# EAGLE design SerLCD_20x4_pb-v01 (EAGLE 7.6.0)
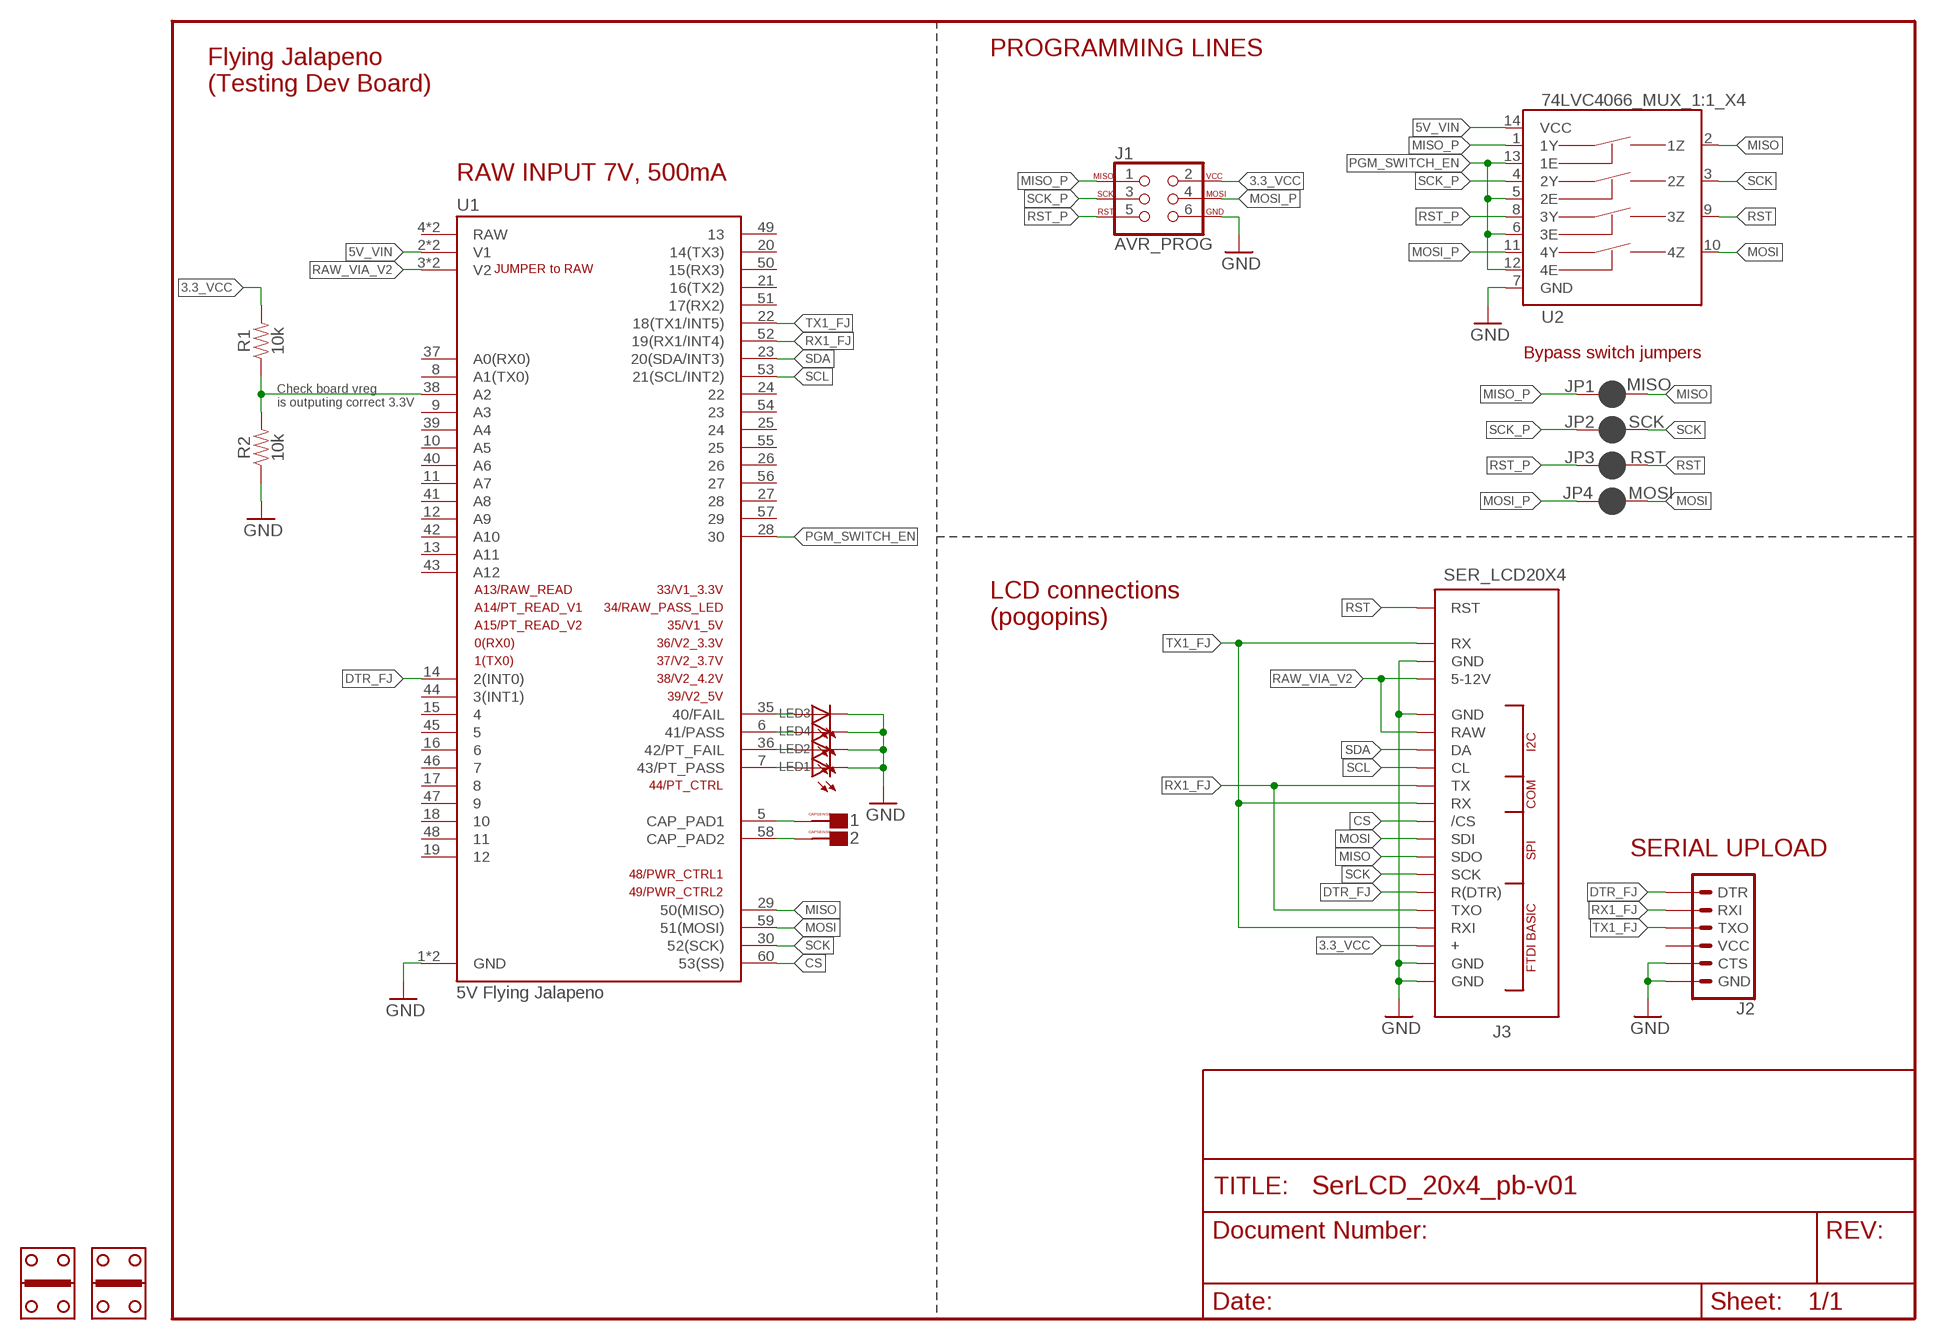
[diagram p0: schematic, sheet 1]

## Parts
1  CAPSENSE_BUTTON_PAD_ONLY  [CAPSENSE_BUTTON_PADS_ONLY]
2  CAPSENSE_BUTTON_PAD_ONLY  [CAPSENSE_BUTTON_PADS_ONLY]
J1  AVR_PROG  AVR_SPI_PROG_3X22X3_LOCK  [2X3_LOCK]
J2  6_PIN_SERIAL_TARGETLOCK  [1X06_LOCK]
J3  SER_LCD20X4  [SER_LCD_20X4]
JP1  MISO  JUMPER-SMT_2_NC_PASTE_NO-SILK  [SMT-JUMPER_2_NC_PASTE_NO-SILK]
JP2  SCK  JUMPER-SMT_2_NC_PASTE_NO-SILK  [SMT-JUMPER_2_NC_PASTE_NO-SILK]
JP3  RST  JUMPER-SMT_2_NC_PASTE_NO-SILK  [SMT-JUMPER_2_NC_PASTE_NO-SILK]
JP4  MOSI  JUMPER-SMT_2_NC_PASTE_NO-SILK  [SMT-JUMPER_2_NC_PASTE_NO-SILK]
LED1  LED1206  [LED-1206]
LED2  LED1206  [LED-1206]
LED3  LED1206  [LED-1206]
LED4  LED1206  [LED-1206]
R1  10k  10KOHM-0603-1/10W-1%  [0603]
R2  10k  10KOHM-0603-1/10W-1%  [0603]
U1  5V Flying Jalapeno  FLYING_JALAPENO_V2MALE  [FLYING_JALAPENO_V2_M]
U2  74LVC4066_MUX_1:1_X4  [SO14]
U$6  GOLD_HINDGEPB  [GOLD_HINDGE]
U$7  GOLD_HINDGEPB  [GOLD_HINDGE]

## Nets
3.3_VCC: J1.2 J3.P$3(+) R1.2
5V_VIN [twelve_mil]: U1.2(V1) U1.32(V1) U2.14(VCC)
CS: J3.P$10(/CS) U1.60(53(SS))
DTR_FJ: J2.1(DTR) J3.P$6(R(DTR)) U1.14(2(INT0))
GND [twelve_mil]: J1.6 J2.5(CTS) J2.6(GND) J3.P$1(GND) J3.P$2(GND) J3.P$16(GND) J3.P$18(GND) LED1.C LED2.C LED3.C LED4.C R2.1 U1.1(GND) U1.31(GND) U2.7(GND)
MISO: J3.P$8(SDO) JP1.2 U1.29(50(MISO)) U2.2(1Z)
MISO_P: J1.1 JP1.1 U2.1(1Y)
MOSI: J3.P$9(SDI) JP4.2 U1.59(51(MOSI)) U2.10(4Z)
MOSI_P: J1.4 JP4.1 U2.11(4Y)
N$1 [eight_mil]: 1.CAPSENSE_PAD(CAPSENSE) U1.5(CAP_PAD1)
N$2: 2.CAPSENSE_PAD(CAPSENSE) U1.58(CAP_PAD2)
N$3 [eight_mil]: LED1.A U1.7(43/PT_PASS)
N$4 [eight_mil]: LED2.A U1.36(42/PT_FAIL)
N$5: LED3.A U1.35(40/FAIL)
N$6: LED4.A U1.6(41/PASS)
N$7: R1.1 R2.2 U1.38(A2)
PGM_SWITCH_EN: U1.28 U2.5(2E) U2.6(3E) U2.12(4E) U2.13(1E)
RAW_VIA_V2: J3.P$15(RAW) J3.P$17(5-12V) U1.3(V2) U1.33(V2)
RST: J3.P$20(RST) JP3.2 U2.9(3Z)
RST_P: J1.5 JP3.1 U2.8(3Y)
RX1_FJ: J2.2(RXI) J3.P$5(TXO) J3.P$12(TX) U1.52(19(RX1/INT4))
SCK: J3.P$7(SCK) JP2.2 U1.30(52(SCK)) U2.3(2Z)
SCK_P: J1.3 JP2.1 U2.4(2Y)
SCL: J3.P$13(CL) U1.53(21(SCL/INT2))
SDA: J3.P$14(DA) U1.23(20(SDA/INT3))
TX1_FJ: J2.3(TXO) J3.P$4(RXI) J3.P$11(RX) J3.P$19(RX) U1.22(18(TX1/INT5))
Unconnected: J2.4(VCC) U1.4(RAW) U1.8(A1(TX0)) U1.9(A3) U1.10(A5) U1.11(A7) U1.12(A9) U1.13(A11) U1.15 U1.16 U1.17 U1.18 U1.19 U1.20(14(TX3)) U1.21(16(TX2)) U1.24 U1.25 U1.26 U1.27 U1.34(RAW) U1.37(A0(RX0)) U1.39(A4) U1.40(A6) U1.41(A8) U1.42(A10) U1.43(A12) U1.44(3(INT1)) U1.45 U1.46 U1.47 U1.48 U1.49 U1.50(15(RX3)) U1.51(17(RX2)) U1.54 U1.55 U1.56 U1.57

## Notes on the sheet
- PROGRAMMING LINES
- Flying Jalapeno
  (Testing Dev Board)
- RAW INPUT 7V, 500mA
- JUMPER to RAW
- Bypass switch jumpers
- Check board vreg 
  is outputing correct 3.3V
- LCD connections
  (pogopins)
- SERIAL UPLOAD

## Library data of the parts
1 2 = Testing:CAPSENSE_BUTTON_PAD_ONLY
J1 = SparkFun-Connectors:AVR_SPI_PROG_3X2: AVR ISP 6 Pin This is the reduced ISP connector for AVR programming. Common on Arduino. This footprint will take up less PCB space and can be used with a 10-pin to 6-pin adapter such as SKU: BOB-08508 **Special note about "TEST_POINT" package. The stop mask is on the top side, so if you want your programming test points to be on the bottom of your board, make sure to place this package on the bottom side of the board. This also ensure that the orientation to program from the bottom side will be correct.
J2 = SparkFun-Connectors:6_PIN_SERIAL_TARGET: 6-pin header connection for use with the "FTDI BASIC" pinout - TARGET SIDE. Also known as "Arduino Serial Program Header". It is used to mate with our FTDI Basic serial programmers using the Arduino IDE. Note, this device has "TARGET" in the name. It is intended to be used on a design that contains a target micro-controller that you wish to program. The "sister" device, named "CABLE" is inteneded to be used on a design that usually lives on the end of your USB cable and prvides the converter chip (FTDI232 or FTDI231x) to commnicate serial RX/TX. You can populate with some of these: Break Away Headers - Straight <https://www.sparkfun.com/products/116> (PRT-00116) For reference (or to suit your programming needs) check out these designs: SparkFun FTDI Basic Breakout - 5V <https://www.sparkfun.com/products/9716> (DEV-09716) SparkFun FTDI Basic Breakout - 3.3V <https://www.sparkfun.com/products/9873> (DEV-09873) SparkFun FTDI SmartBasic <https://www.sparkfun.com/products/12935> (DEV-12935) SparkFun Beefy 3 - FTDI Basic Breakout <https://www.sparkfun.com/products/13746> (DEV-13746)
J3 = SerLCD_dimensions:SER_LCD
JP1-JP4 = SparkFun-Jumpers:JUMPER-SMT_2_NC_PASTE: Normally closed solder jumper This jumper has an aperture in the stencil to allow solder paste to bridge the split in the wire so it's normally closed (NC). Wick off the solder to open the connection. Reapply solder to reclose the connection.
LED1-LED4 = Testing:LED: LEDs Standard schematic elements and footprints for 5mm, 3mm, 1206, and 0603 sized LEDs. 5mm - Spark Fun Electronics SKU : COM-00529 (and others)
R1 R2 = SparkFun-Resistors:10KOHM: 10kΩ resistor A resistor is a passive two-terminal electrical component that implements electrical resistance as a circuit element. Resistors act to reduce current flow, and, at the same time, act to lower voltage levels within circuits. - Wikipedia; PROD_ID: RES-00824
U1 = Testing:FLYING_JALAPENO_V2
U2 = Testing:74LVC4066_MUX_1:1_X4
U$6 U$7 = Testing:GOLD_HINDGE

## Net classes
1 vcc1: width 0.203 mm
3 VCC2: width 0.381 mm, drill 0.508 mm, clearance 0.254 mm to class 0
8 eight_mil: width 0.203 mm, clearance 0.127 mm
9 twelve_mil: width 0.305 mm, clearance 0.127 mm
10 twenty_mil: width 0.508 mm, clearance 0.127 mm
11 thirty_mil: width 0.762 mm, clearance 0.127 mm
13 20_mil: width 0.508 mm, drill 0.508 mm

## Board
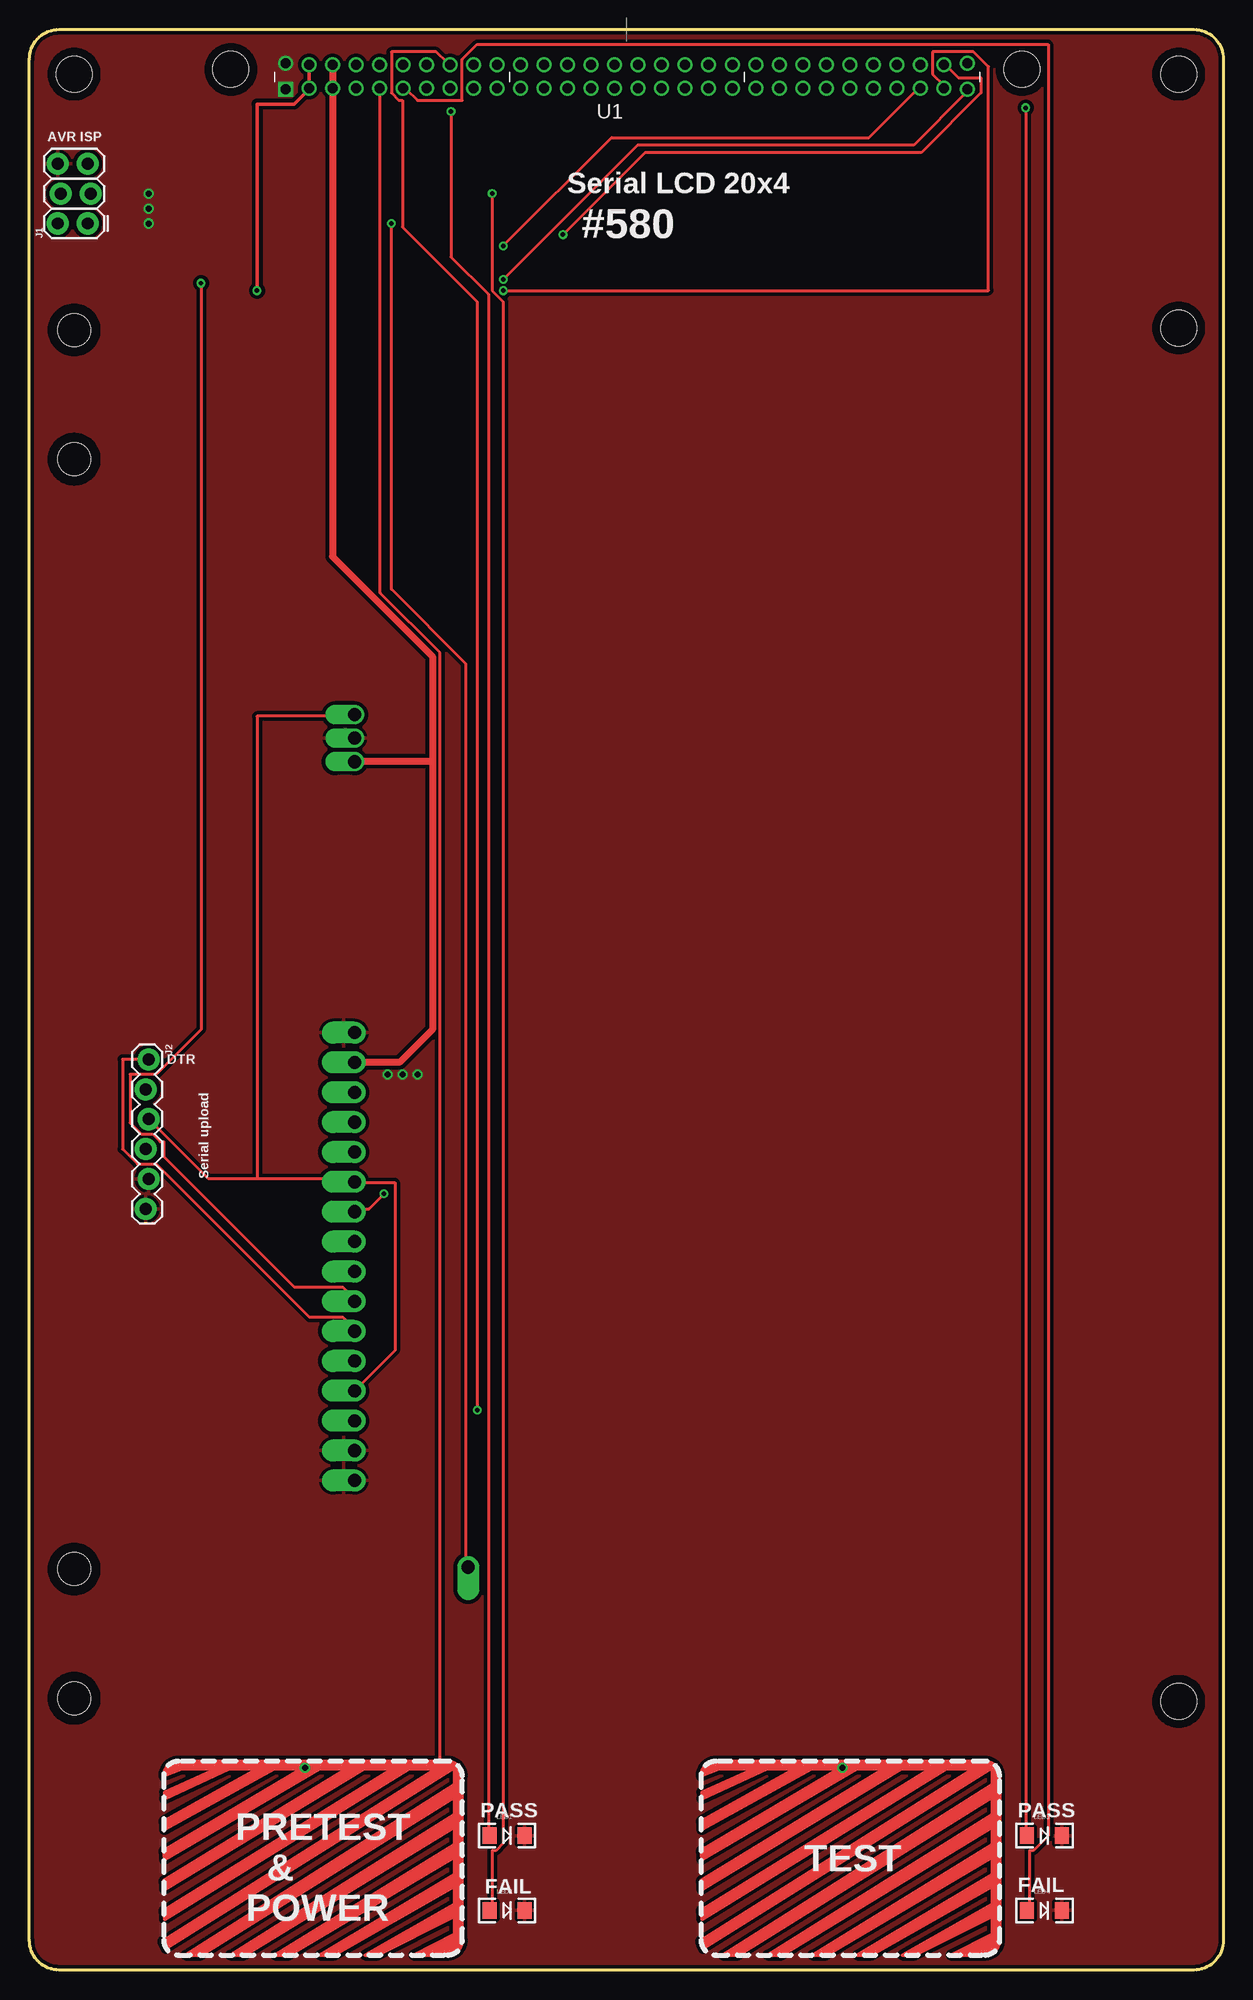
[diagram p1: board, top side]
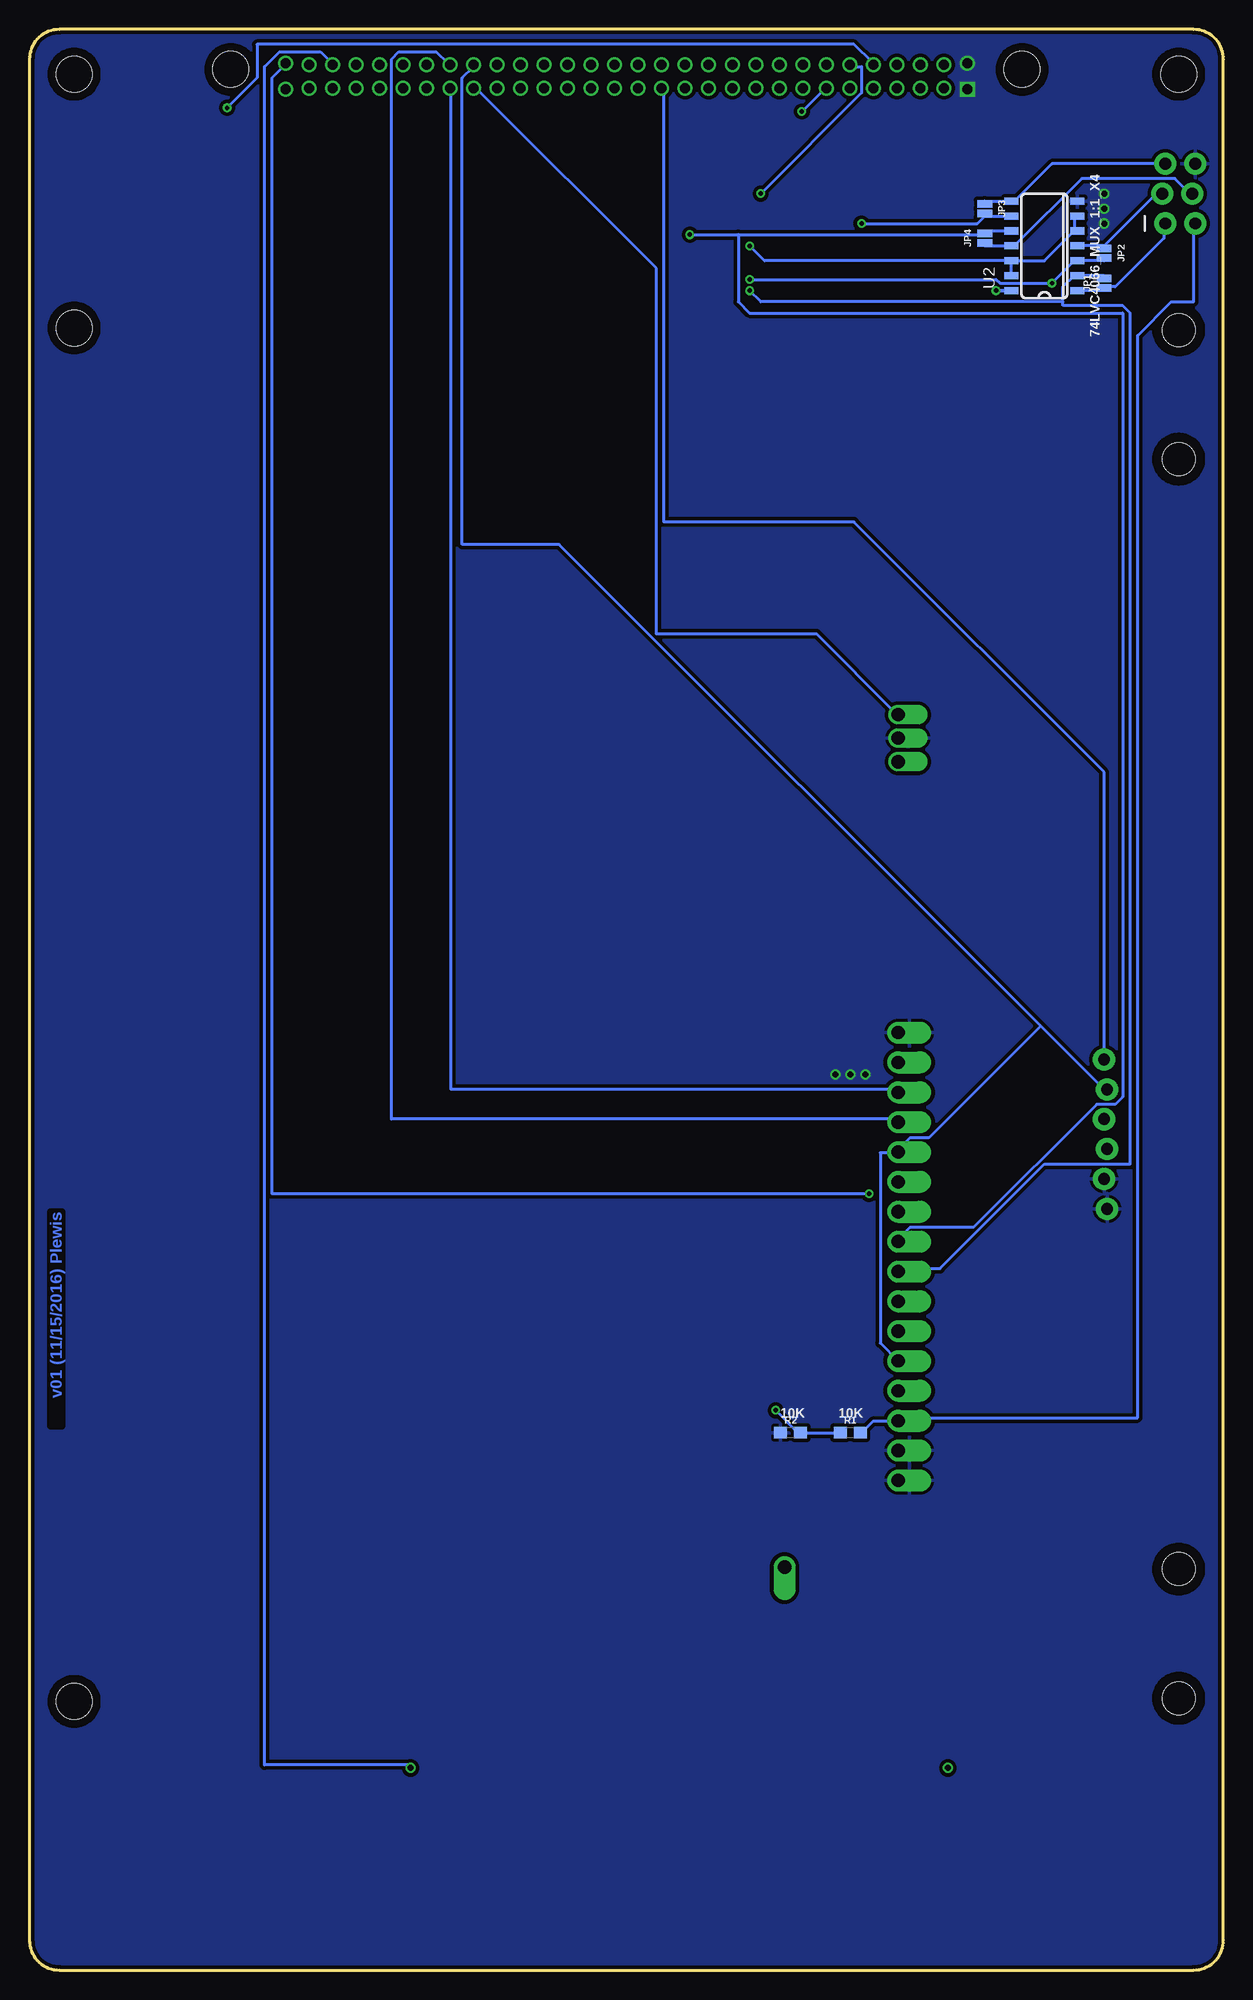
[diagram p2: board, bottom side, seen from below]

Size 101.6 x 165.1 mm. Coordinates in mm from the lower left corner, seen from the top.
Outline: 2.54,0 arc-90 0,2.54 0,162.56 arc-90 2.54,165.1 99.06,165.1 arc-90 101.6,162.56 101.6,2.54 arc-90 99.06,0 2.54,0
Copper layers (1*16): Top 0.035mm / dielectric 1.5mm / Bottom 0.035mm
Design rules "SparkFun-2-layer-TIGHT *": minimum track width 10mil, minimum drill 15mil, track to track 7mil, track to pad 7mil, pad to pad 7mil, via to via 7mil, smd to smd 7mil, copper to edge 7mil, drill to drill 7mil, minimum pad ring 7mil, minimum via ring 7mil, stop-mask expansion 4mil, vias tented up to drill 25mil, thermal gap 10mil

### Footprints (pad centres in the part's own frame; a part is rotated, then mirrored left to right if it is on the bottom)
CAPSENSE_BUTTON_PADS_ONLY = drill 0.508: CAPSENSE_PAD -0.686,7.036
2X3_LOCK = drill 1.016 pad 1.88: 1 0,0.127; 2 0,2.667; 3 2.54,-0.127; 4 2.54,2.413; 5 5.08,0.127; 6 5.08,2.667
1X06_LOCK = drill 1.016 pad 1.88: 1 0,0; 2 2.54,-0.254; 3 5.08,0; 4 7.62,-0.254; 5 10.16,0; 6 12.7,-0.254
SER_LCD_20X4 = drill 1.118 pad 1.88 offset: P$1 9.906,57.404; P$2 12.446,57.404; P$3 14.986,57.404; P$4 17.526,57.404; P$5 20.066,57.404; P$6 22.606,57.404; P$7 25.146,57.404; P$8 27.686,57.404; P$9 30.226,57.404; P$10 32.766,57.404; P$11 35.306,57.404; P$12 37.846,57.404; P$13 40.386,57.404; P$14 42.926,57.404; P$15 45.466,57.404; P$16 48.006,57.404; P$20 2.54,47.752 | drill 1.118 pad 1.524 offset: P$17 71.044,57.404; P$18 73.05,57.404; P$19 75.057,57.404
SMT-JUMPER_2_NC_PASTE_NO-SILK = smd 0.635 x 1.27: 1 -0.406,0; 2 0.406,0
LED-1206 = smd 1.2 x 1.4: A -1.5,0; C 1.5,0
0603 = smd 1.1 x 1: 1 -0.85,0; 2 0.85,0
FLYING_JALAPENO_V2_M = drill 0.85 square: 1 -29,-5.1 | drill 0.85: 2 -27,-5; 3 -25,-5; 4 -23,-5; 5 -21,-5; 6 -19,-5; 7 -17,-5; 8 -15,-5; 9 -13,-5; 10 -11,-5; 11 -9,-5; 12 -7,-5; 13 -5,-5; 14 -3,-5; 15 -1,-5; 16 1,-5; 17 3,-5; 18 5,-5; 19 7,-5; 20 9,-5; 21 11,-5; 22 13,-5; 23 15,-5; 24 17,-5; 25 19,-5; 26 21,-5; 27 23,-5; 28 25,-5; 29 27,-5; 30 29,-5.1; 31 -29,-2.9; 32 -27,-3; 33 -25,-3; 34 -23,-3; 35 -21,-3; 36 -19,-3; 37 -17,-3; 38 -15,-3; 39 -13,-3; 40 -11,-3; 41 -9,-3; 42 -7,-3; 43 -5,-3; 44 -3,-3; 45 -1,-3; 46 1,-3; 47 3,-3; 48 5,-3; 49 7,-3; 50 9,-3; 51 11,-3; 52 13,-3; 53 15,-3; 54 17,-3; 55 19,-3; 56 21,-3; 57 23,-3; 58 25,-3; 59 27,-3; 60 29,-2.9 | hole 3.048: 33.655,-3.404; -33.655,-3.404
SO14 = smd 0.6 x 1.2: 1 -3.175,-2.8; 2 -1.905,-2.8; 3 -0.635,-2.8; 4 0.635,-2.8; 5 1.905,-2.8; 6 3.175,-2.8; 7 4.445,-2.8; 8 4.445,2.8; 9 3.175,2.8; 10 1.905,2.8; 11 0.635,2.8; 12 -0.635,2.8; 13 -1.905,2.8; 14 -3.175,2.8
STAND-OFF-TIGHT = hole 3.048: 0,0
GOLD_HINDGE = hole 2.794: 3.81,4.077; 3.81,15.07

### Placement (x,y rotation side)
1  24.13,10.16 0 top
2  69.85,10.16 0 top
J1  5.08,148.59 90 top
J2  10.16,77.47 270 top
J3  85.09,31.75 90 top
JP1  10.16,143.51 90 bottom
JP2  10.16,146.05 270 bottom
JP3  20.32,149.86 270 bottom
JP4  20.32,147.32 90 bottom
LED1  40.64,11.43 0 top
LED2  40.64,5.08 0 top
LED3  86.36,11.43 0 top
LED4  86.36,5.08 0 top
R1  31.75,45.72 0 bottom
R2  36.83,45.72 0 bottom
U1  50.8,165.1 0 top
U2  15.24,146.05 90 bottom
U$1  [STAND-OFF-TIGHT]  97.79,161.29 0 top
U$2  [STAND-OFF-TIGHT]  3.81,161.29 0 top
U$3  [STAND-OFF-TIGHT]  97.79,139.7 0 top
U$6  0,124.46 0 top
U$7  0,19.05 0 top
U$8  [STAND-OFF-TIGHT]  97.79,22.86 0 top

### Tracks (layer width: path | path; a pad name or v marks a point on that pad's centre or on a via)
3.3_VCC
  Bottom 0.254: R1.2 30.8,45.72 29.84,46.67 27.94,46.67 J3.P$3 27.62,46.99 7.3,46.99 7.3,139.06 4.45,141.92 2.54,141.92 2.54,148.59 J1.2
5V_VIN  (via drill 0.38)
  Top 0.305: v19.37,142.88 19.37,158.75 22.54,158.75 23.81,160.02 U1.2 23.81,160.34 23.81,161.93 U1.32
  Bottom 0.305: v19.37,142.88 U2.14
CS  (via drill 0.38)
  Top 0.254: v30.16,66.04 28.89,64.77 27.94,64.77 J3.P$10
  Bottom 0.254: v30.16,66.04 80.96,66.04 80.96,160.97 80.01,161.93 U1.60
DTR_FJ
  Top 0.254: J2.1 7.94,77.47 7.94,69.85 9.21,68.58 10.79,68.58 23.81,55.56 26.67,55.56 27.62,54.61 J3.P$6
  Bottom 0.254: J2.1 10.16,101.92 31.43,123.19 47.62,123.19 47.62,160.02 U1.14
GND  (via drill 0.51)
  other vias: 10.16,151.13 10.16,149.86 10.16,148.59 33.02,76.2 31.75,76.2 30.48,76.2
  pour Bottom (isolate 0.305): 0,0 0,165.1 101.6,165.1 101.6,0
  pour Top (isolate 0.305): 0,0 0,165.1 101.6,165.1 101.6,0
MISO  (via drill 0.38)
  Top 0.254: v40.32,142.88 81.6,142.88 81.6,161.93 80.33,163.19 76.83,163.19 76.83,161.29 77.79,160.34 U1.29
  Bottom 0.254: JP1.2 10.16,144.15 U2.2 12.7,144.15 13.65,143.19 13.65,141.92 | 13.65,141.92 13.65,141.6 8.57,141.6 7.94,140.97 7.94,68.58 15.24,68.58 24.13,59.69 27.62,59.69 J3.P$8 | v40.32,142.88 39.37,141.92 13.65,141.92
MISO_P
  Bottom 0.254: U2.1 10.16,142.88 JP1.1 10.16,143.19 9.21,143.19 5.08,147.32 5.08,148.59 J1.1
MOSI  (via drill 0.38)
  Top 0.254: v45.4,147.64 52.39,154.62 75.88,154.62 80.96,159.7 80.96,160.97 79.06,160.97 78.11,161.93 U1.59
  Bottom 0.254: U2.10 20.32,147.96 JP4.2 20.32,147.64 41.27,147.64 | v45.4,147.64 41.27,147.64 | 41.27,147.64 41.27,141.92 40.32,140.97 8.57,140.97 8.57,74.3 9.21,73.66 10.79,73.66 21.27,63.18 26.67,63.18 27.62,62.23 J3.P$9
MOSI_P
  Bottom 0.254: JP4.1 20.32,146.69 U2.11 17.78,146.69 12.06,152.4 4.13,152.4 2.86,151.13 J1.4
N$1
  Top 0.254: U1.5 29.84,160.02 29.84,117.16 34.92,112.08 34.92,17.46 23.5,17.46 1.CAPSENSE_PAD
N$2
  Bottom 0.254: U1.58 75.88,162.24 76.83,163.19 80.33,163.19 81.6,161.93 81.6,17.46 69.22,17.46 2.CAPSENSE_PAD
N$3  (via drill 0.38)
  Top 0.254: v35.88,158.12 35.88,145.73 39.05,142.56 39.05,11.43 LED1.A
  Bottom 0.254: v35.88,158.12 33.97,160.02 U1.7
N$4  (via drill 0.38)
  Top 0.254: v39.37,151.13 39.37,142.88 40.32,141.92 40.32,10.79 39.69,10.16 39.37,10.16 39.37,5.08 LED2.A
  Bottom 0.254: v39.37,151.13 30.8,159.7 30.8,161.93 31.75,161.93 U1.36
N$5  (via drill 0.38)
  Top 0.254: v84.77,158.43 84.77,11.43 LED3.A
  Bottom 0.254: v84.77,158.43 82.23,160.97 82.23,163.83 31.43,163.83 29.84,162.24 U1.35
N$6
  Top 0.254: LED4.A 85.09,5.08 85.09,10.16 85.41,10.16 86.68,11.43 86.68,163.83 38.1,163.83 36.83,162.56 36.83,159.07 33.02,159.07 32.07,160.02 U1.6
N$7  (via drill 0.38)
  Top 0.254: v38.1,47.62 38.1,141.92 31.75,148.27 31.75,159.07 31.43,159.07 30.8,159.7 30.8,163.19 34.61,163.19 35.56,162.24 U1.38
  Bottom 0.254: R1.1 R2.2 36.2,45.72 v38.1,47.62
PGM_SWITCH_EN  (via drill 0.38)
  Top 0.254: v40.32,146.69 49.53,155.89 71.44,155.89 75.56,160.02 U1.28
  Bottom 0.254: 12.7,147.96 12.7,149.22 U2.6 | 18.1,145.41 18.1,144.15 U2.13 | 12.7,147.96 15.24,145.41 U2.12 18.1,145.41 | 12.7,147.96 U2.5 | v40.32,146.69 39.05,145.41 18.1,145.41
RAW_VIA_V2
  Top 0.61: U1.33 U1.3 25.8,120.25 34.29,111.76 34.29,102.87 | 34.29,102.87 34.29,80.01 31.5,77.22 J3.P$15 | J3.P$17 27.76,102.87 34.29,102.87
RST  (via drill 0.38)
  Top 0.254: v30.8,148.59 30.8,117.47 37.15,111.12 37.15,34.29 J3.P$20
  Bottom 0.254: 20.32,149.22 U2.9 | 20.32,149.22 20.95,148.59 v30.8,148.59 | 20.32,149.22 JP3.2
RST_P
  Bottom 0.254: JP3.1 20.32,150.5 U2.8 17.78,150.5 14.61,153.67 J1.5
RX1_FJ
  Bottom 0.254: J3.P$5 29.21,53.34 29.21,69.53 27.94,69.53 J3.P$12 27.62,69.85 26.67,70.8 25.08,70.8 15.56,80.33 | 15.56,80.33 10.16,74.93 J2.2 | 15.56,80.33 56.52,121.28 64.77,121.28 64.77,160.97 63.82,161.93 U1.52
SCK  (via drill 0.38)
  Top 0.254: v40.32,143.83 51.75,155.26 75.25,155.26 79.69,159.7 U1.30 | v14.61,143.51 14.61,80.01 10.79,76.2 8.57,76.2 8.57,72.07 9.53,71.12 10.48,71.12 11.11,70.48 11.43,70.48 11.43,69.22 22.54,58.1 26.67,58.1 27.62,57.15 J3.P$7
  Bottom 0.254: JP2.2 10.16,145.41 U2.3 12.7,145.41 v14.61,143.51 19.05,143.51 19.37,143.83 v40.32,143.83
SCK_P
  Bottom 0.254: 10.16,146.69 U2.4 | 10.16,146.69 5.71,151.13 J1.3 | 10.16,146.69 JP2.1
SCL
  Bottom 0.254: U1.53 66.04,162.24 66.99,163.19 70.17,163.19 70.8,162.56 70.8,72.39 27.94,72.39 J3.P$13
SDA
  Bottom 0.254: U1.23 65.72,160.02 65.72,74.93 27.94,74.93 J3.P$14
TX1_FJ
  Top 0.254: J3.P$4 31.11,52.7 31.11,66.99 27.94,66.99 J3.P$11 27.62,67.31 19.37,67.31 | J2.3 15.24,67.31 19.37,67.31 | 19.37,67.31 19.37,106.68 27.62,106.68 J3.P$19
  Bottom 0.254: U1.22 63.5,160.02 48.26,144.78 48.26,113.67 34.61,113.67 27.94,107 J3.P$19

### Text on the board
Bottom: v01 (11/15/2016) Plewis
tPlace: AVR ISP | Serial LCD 20x4 | #580 | DTR | Serial upload | PASS | PASS | TEST | FAIL | FAIL | PRETEST / & / POWER
bPlace: 10K | 10K